# Altium schematic sheet 24CXX.SchDoc
size A4
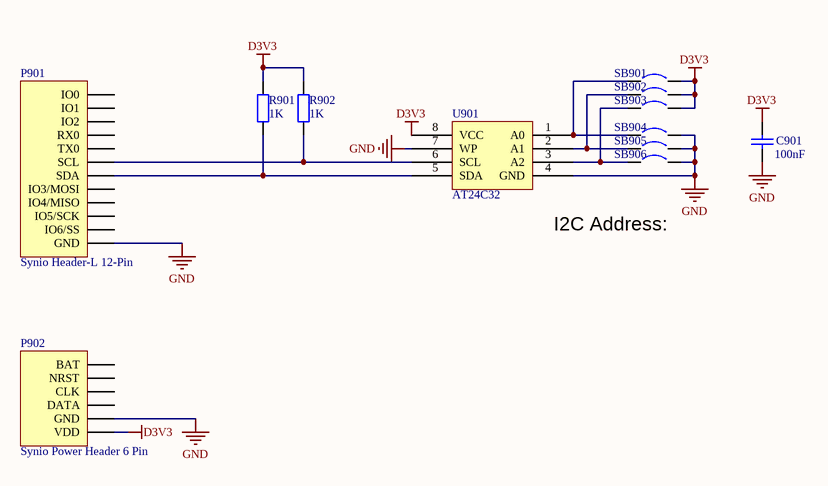
[diagram p0: 24CXX.SchDoc]

## Parts
C901  100nF  [0603M]
P901  Synio Header-L 12-Pin  [HDR1X12]
P902  Synio Power Header 6 Pin  [HDR1X6/2.54MM]
R901  1K  [R0603]
R902  1K  [R0603]
SB901  Circuit Breaker  [JP2_SMD]  (value not drawn)
SB902  Circuit Breaker  [JP2_SMD]  (value not drawn)
SB903  Circuit Breaker  [JP2_SMD]  (value not drawn)
SB904  Circuit Breaker  [JP2_SMD]  (value not drawn)
SB905  Circuit Breaker  [JP2_SMD]  (value not drawn)
SB906  Circuit Breaker  [JP2_SMD]  (value not drawn)
U901  AT24C32  [SO8W_M]

## Nets
D3V3: C901.1 P902.1(VDD) R901.2 R902.2 SB901.2 SB902.2 SB903.2 U901.8(VCC)
GND: C901.2 P901.1(GND) P902.2(GND) SB904.2 SB905.2 SB906.2 U901.4(GND) U901.7(WP)
NetP901_6: P901.6(SDA) R901.1 U901.5(SDA)
NetP901_7: P901.7(SCL) R902.1 U901.6(SCL)
NetSB901_1: SB901.1 SB904.1 U901.1(A0)
NetSB902_1: SB902.1 SB905.1 U901.2(A1)
NetSB903_1: SB903.1 SB906.1 U901.3(A2)

Not connected (* = marked no-connect by the designer): P901 2(IO6/SS) 3(IO5/SCK) 4(IO4/MISO) 5(IO3/MOSI) 8(TX0) 9(RX0) 10(IO2) 11(IO1) 12(IO0); P902 3(DATA) 4(CLK) 5(NRST) 6(BAT)

## Notes on the sheet
- (near U901) I2C Address:

## Library data of the parts
C901 = Cap: Capacitor; Value: 10nF; Published: 8-Jun-2000; Revision: July-2002: Re-released for DXP Platform.; Publisher: Altium Limited
P901 = Synio Header-L 12-Pin: Synio Header-L, 12-Pin; LatestRevisionDate: 17-Jul-2002; LatestRevisionNote: Re-released for DXP Platform.; Publisher: Altium Limited
R901 R902 = Res2: Resistor; Published: 8-Jun-2000; LatestRevisionDate: 17-Jul-2002; LatestRevisionNote: Re-released for DXP Platform.; PackageReference: AXIAL-0.4; Publisher: Altium Limited; Value: 1K
SB901-SB906 = Circuit Breaker: Solder: YES; Published: 24-Mar-1999; Revision: July-2002: Re-released for DXP Platform.; Publisher: Altium Limited
U901 = At24CXX: IIC EEPROM